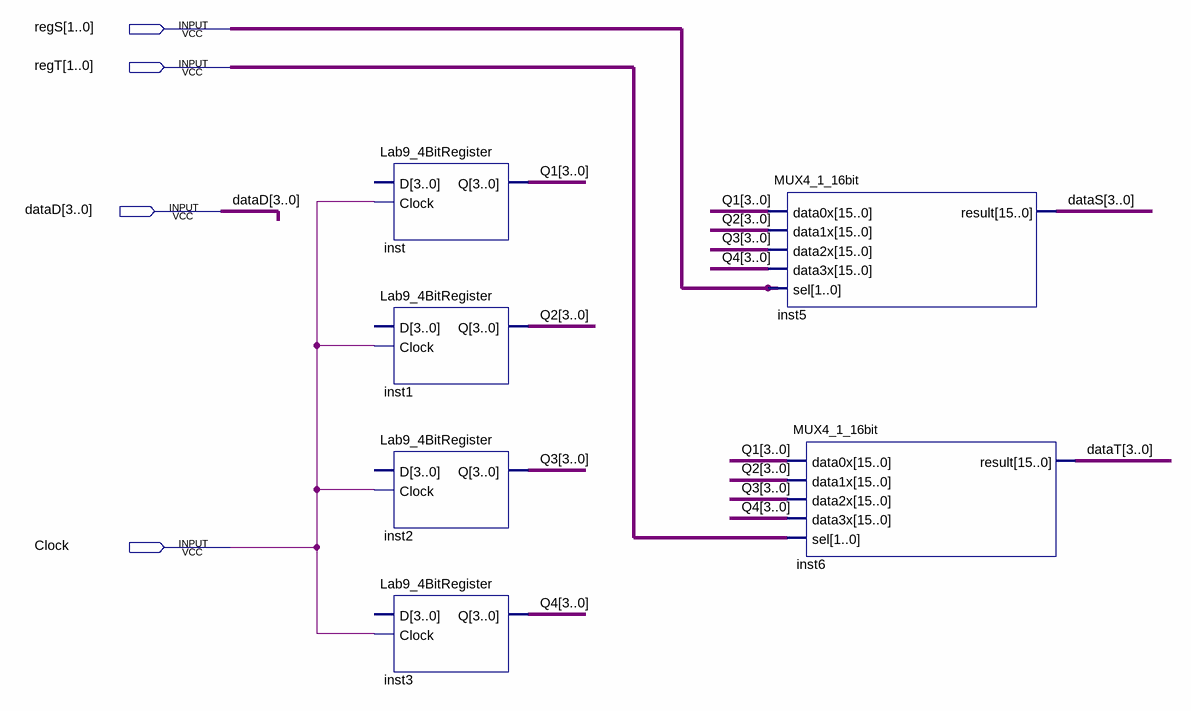
[diagram p0: schematic sheet]
// Quartus schematic Lab9_4x4bitRegisterFile.bdf as structural Verilog: 6 symbols, 4 pins
module Lab9_4x4bitRegisterFile (
  input  [1:0] regS,
  input  [1:0] regT,
  input  [3:0] dataD,
  input  Clock
);

  wire [3:0] dataS, dataT, Q1, Q2, Q3, Q4;

  Lab9_4BitRegister inst (.Clock(Clock), .Q(Q1));  // open: D
  Lab9_4BitRegister inst1 (.Clock(Clock), .Q(Q2));  // open: D
  Lab9_4BitRegister inst2 (.Clock(Clock), .Q(Q3));  // open: D
  Lab9_4BitRegister inst3 (.Clock(Clock), .Q(Q4));  // open: D
  MUX4_1_16bit inst5 (.data0x(Q1), .data1x(Q2), .data2x(Q3), .data3x(Q4), .sel(regS), .result(dataS));
  MUX4_1_16bit inst6 (.data0x(Q1), .data1x(Q2), .data2x(Q3), .data3x(Q4), .sel(regT), .result(dataT));
endmodule
